# Altium schematic sheet Thermostat_16CH.SchDoc: Thermostat 8CH v1.1
size 420 x 297 mm; Author: G.Kasprowicz; CompanyName: WUT ISE; DrawnBy: G.Kasprowicz; Organization: WUT ISE; Address1: PW ISE; Address2: Nowowiejska 15/19 00-665 Warsaw; Address3: gkasprow@gmail.com; DocumentNumber: 1; Revision: 2; SheetNumber: 1; SheetTotal: 9; ModifiedBy: -; CheckedDate: -; Title2: TOP; DivGrp: WUT ISE; Designer: G.Kasprowicz; ModifiedDate: -; ProjectName: Sensor Box
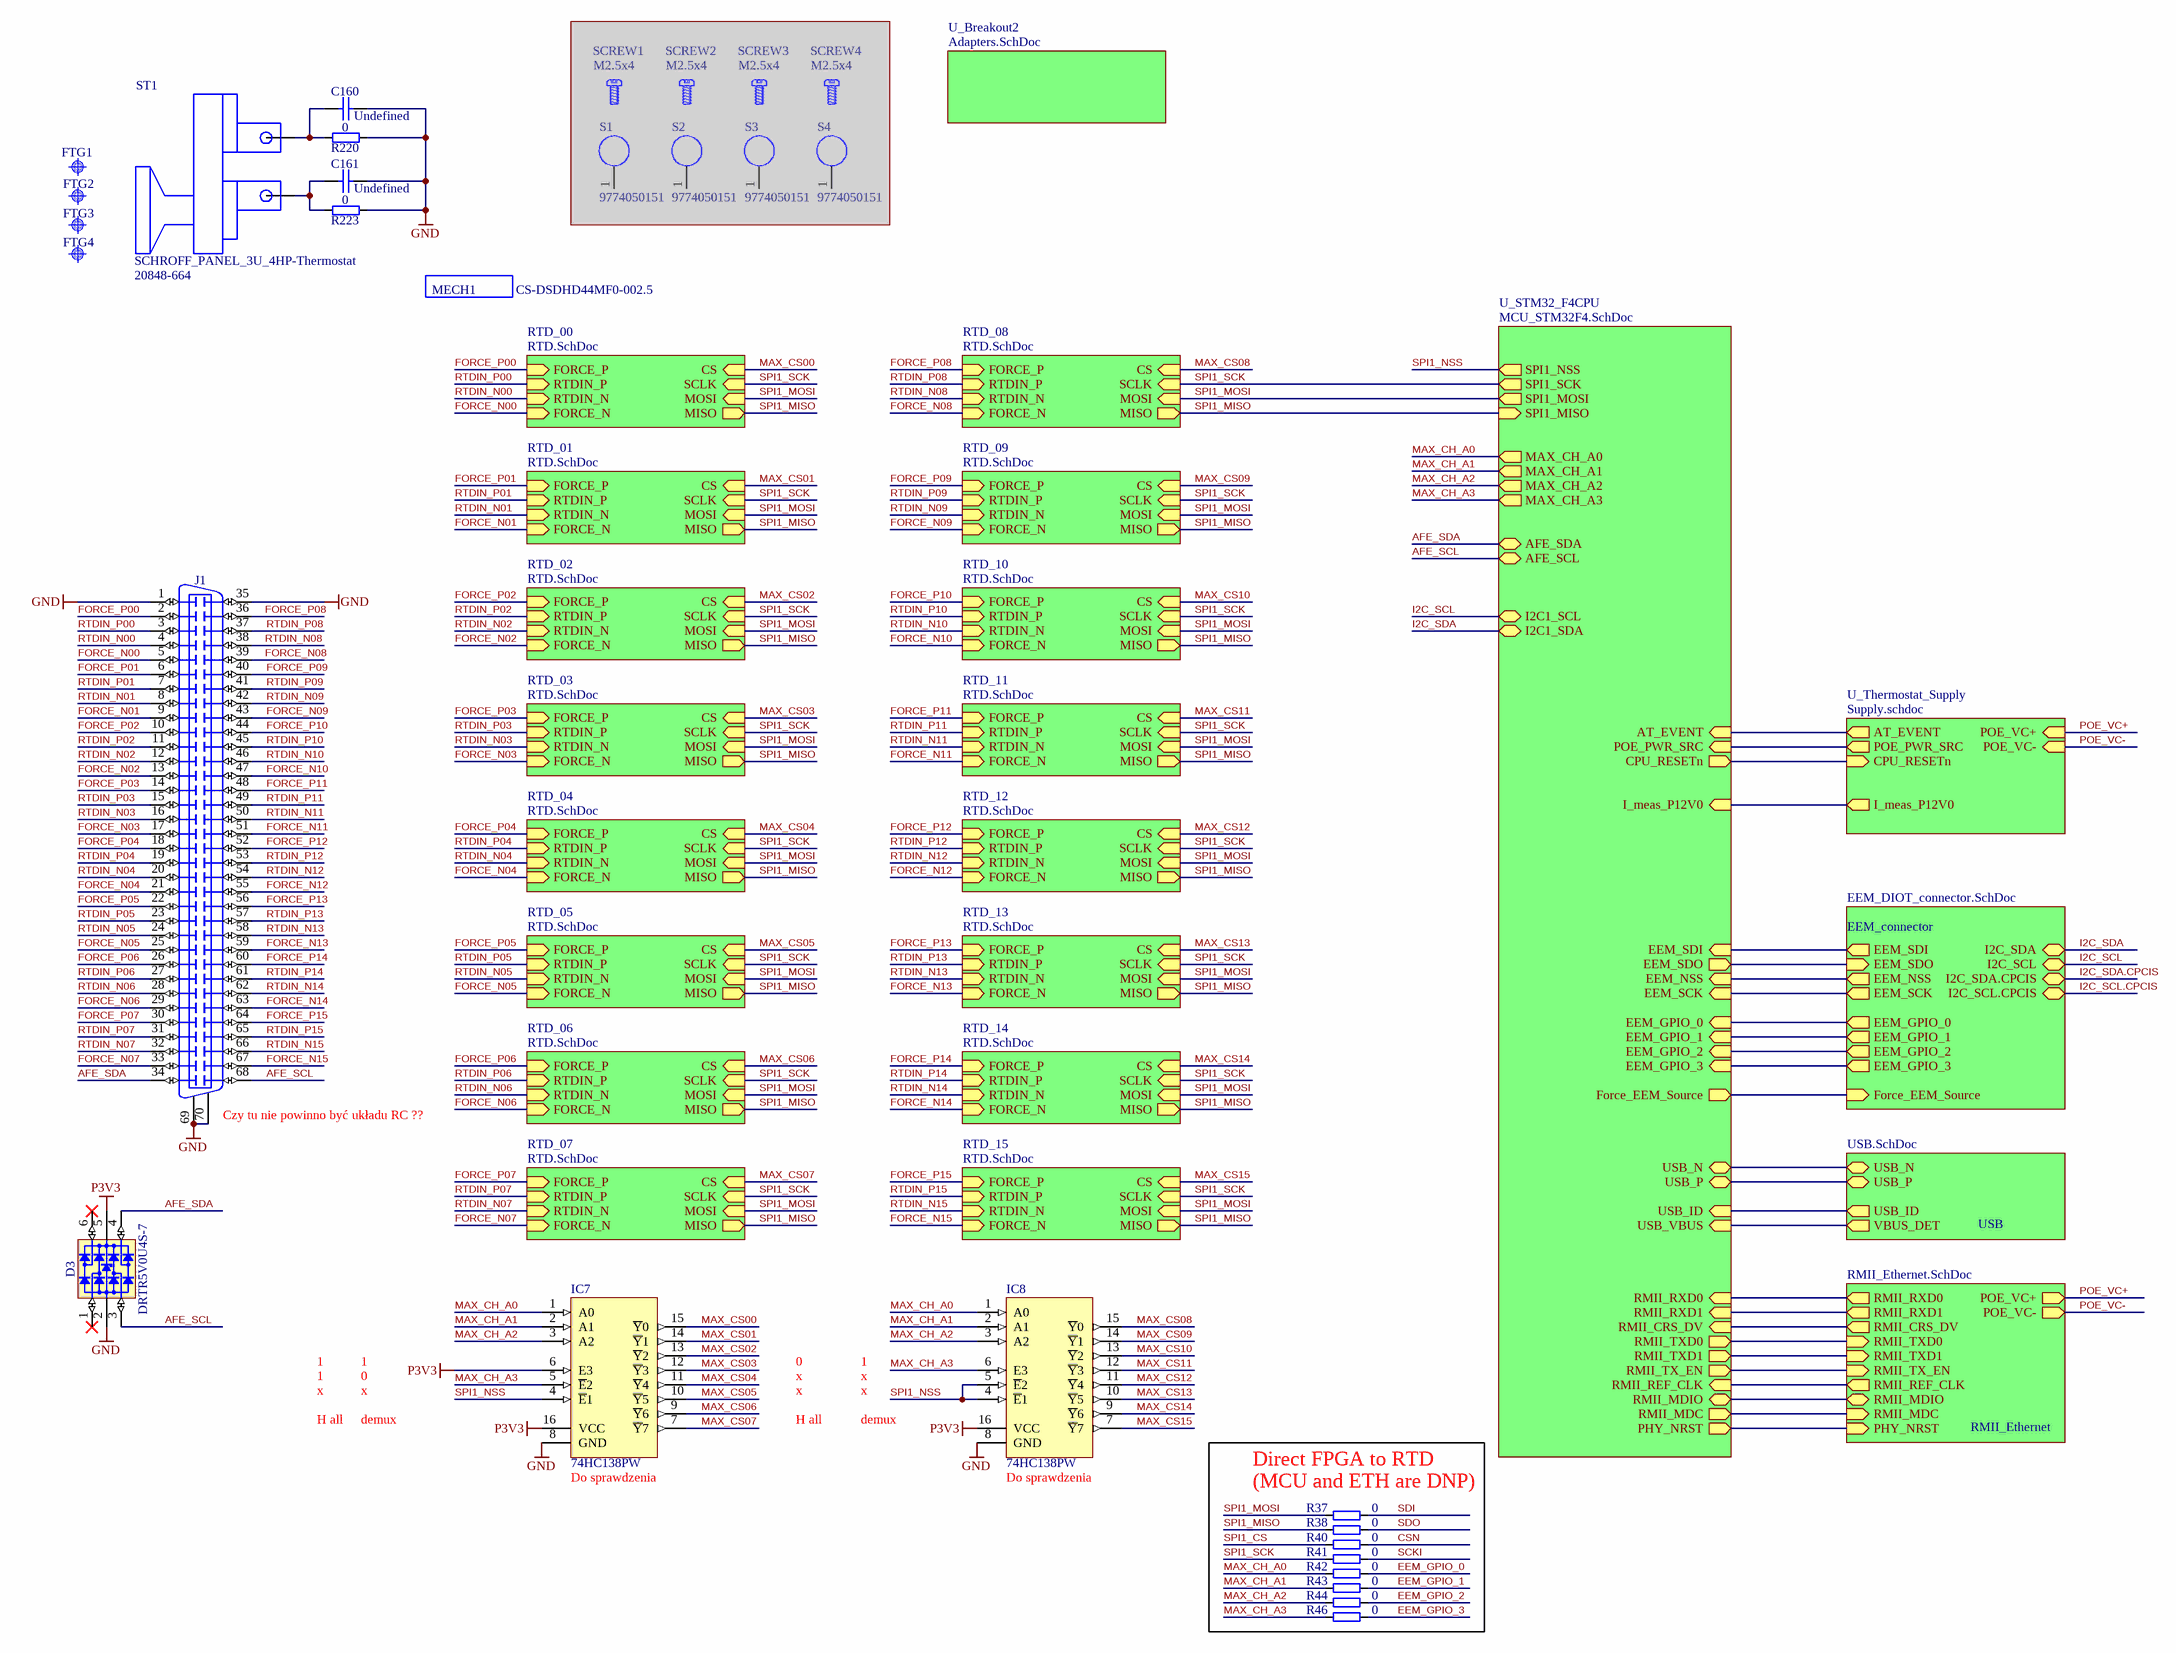
[diagram p0: Thermostat_16CH.SchDoc]

## Parts
C160  Undefined  [CAPC2012X135N]
C161  Undefined  [CAPC2012X135N]
D3  DRTR5V0U4S-7  [SOT65P210X110-6N]
FTG1  Use only in PCB  [FIDUCIAL_TOP_S100-200]  (value not drawn)  (no BOM)
FTG2  Use only in PCB  [FIDUCIAL_TOP_S100-200]  (value not drawn)  (no BOM)
FTG3  Use only in PCB  [FIDUCIAL_TOP_S100-200]  (value not drawn)  (no BOM)
FTG4  Use only in PCB  [FIDUCIAL_TOP_S100-200]  (value not drawn)  (no BOM)
IC7  74HC138PW  [SOP65P640X110-16N]
IC8  74HC138PW  [SOP65P640X110-16N]
J1  DNP  [MOLEX_71430-0013]  (value not drawn)
MECH1  CS-DSDHD44MF0-002.5  (mechanical)
R37  0  [RESC1608X55N]
R38  0  [RESC1608X55N]
R40  0  [RESC1608X55N]
R41  0  [RESC1608X55N]
R42  0  [RESC1608X55N]
R43  0  [RESC1608X55N]
R44  0  [RESC1608X55N]
R46  0  [RESC1608X55N]
R220  0  [RESC1608X55N]
R223  0  [RESC1608X55N]
S1  9774050151  [9774050151]  (masked out: inside a compile mask, not in the netlist)
S2  9774050151  [9774050151]  (masked out: inside a compile mask, not in the netlist)
S3  9774050151  [9774050151]  (masked out: inside a compile mask, not in the netlist)
S4  9774050151  [9774050151]  (masked out: inside a compile mask, not in the netlist)
SCREW1  M2.5x4  [BOSSARD_BN5687-3061587_v]  (masked out: inside a compile mask, not in the netlist)
SCREW2  M2.5x4  [BOSSARD_BN5687-3061587_v]  (masked out: inside a compile mask, not in the netlist)
SCREW3  M2.5x4  [BOSSARD_BN5687-3061587_v]  (masked out: inside a compile mask, not in the netlist)
SCREW4  M2.5x4  [BOSSARD_BN5687-3061587_v]  (masked out: inside a compile mask, not in the netlist)
ST1  SCHROFF_PANEL_3U_4HP-Thermostat  Manufacturer Part Number 2: 20848-664  [SCHROFF_PANEL_3HP_4U - Thermostat]

## Sub-sheets
EEM_connector = EEM_DIOT_connector.SchDoc: I2C_SDA (bidir), I2C_SCL (bidir), EEM_GPIO_0 (out), EEM_GPIO_1 (out), EEM_GPIO_2 (out), EEM_GPIO_3 (out), EEM_SCK (out), EEM_SDI (out), EEM_NSS (out), EEM_SDO (in), Force_EEM_Source (in), I2C_SDA.CPCIS (bidir), I2C_SCL.CPCIS (bidir)
RMII_Ethernet = RMII_Ethernet.SchDoc: RMII_TXD0 (in), RMII_TX_EN (in), RMII_RXD0 (out), RMII_REF_CLK (out), RMII_CRS_DV (out), RMII_MDC (in), RMII_MDIO (bidir), PHY_NRST (in), RMII_TXD1 (in), RMII_RXD1 (out), POE_VC+ (out), POE_VC- (out)
RTD_00 = RTD.SchDoc: SCLK (in), MOSI (in), CS (in), MISO (out), RTDIN_P (in), RTDIN_N (in), FORCE_P (in), FORCE_N (in)
RTD_01 = RTD.SchDoc: SCLK (in), MOSI (in), CS (in), MISO (out), RTDIN_P (in), RTDIN_N (in), FORCE_P (in), FORCE_N (in)
RTD_02 = RTD.SchDoc: SCLK (in), MOSI (in), CS (in), MISO (out), RTDIN_P (in), RTDIN_N (in), FORCE_P (in), FORCE_N (in)
RTD_03 = RTD.SchDoc: SCLK (in), MOSI (in), CS (in), MISO (out), RTDIN_P (in), RTDIN_N (in), FORCE_P (in), FORCE_N (in)
RTD_04 = RTD.SchDoc: SCLK (in), MOSI (in), CS (in), MISO (out), RTDIN_P (in), RTDIN_N (in), FORCE_P (in), FORCE_N (in)
RTD_05 = RTD.SchDoc: SCLK (in), MOSI (in), CS (in), MISO (out), RTDIN_P (in), RTDIN_N (in), FORCE_P (in), FORCE_N (in)
RTD_06 = RTD.SchDoc: SCLK (in), MOSI (in), CS (in), MISO (out), RTDIN_P (in), RTDIN_N (in), FORCE_P (in), FORCE_N (in)
RTD_07 = RTD.SchDoc: SCLK (in), MOSI (in), CS (in), MISO (out), RTDIN_P (in), RTDIN_N (in), FORCE_P (in), FORCE_N (in)
RTD_08 = RTD.SchDoc: SCLK (in), MOSI (in), CS (in), MISO (out), RTDIN_P (in), RTDIN_N (in), FORCE_P (in), FORCE_N (in)
RTD_09 = RTD.SchDoc: SCLK (in), MOSI (in), CS (in), MISO (out), RTDIN_P (in), RTDIN_N (in), FORCE_P (in), FORCE_N (in)
RTD_10 = RTD.SchDoc: SCLK (in), MOSI (in), CS (in), MISO (out), RTDIN_P (in), RTDIN_N (in), FORCE_P (in), FORCE_N (in)
RTD_11 = RTD.SchDoc: SCLK (in), MOSI (in), CS (in), MISO (out), RTDIN_P (in), RTDIN_N (in), FORCE_P (in), FORCE_N (in)
RTD_12 = RTD.SchDoc: SCLK (in), MOSI (in), CS (in), MISO (out), RTDIN_P (in), RTDIN_N (in), FORCE_P (in), FORCE_N (in)
RTD_13 = RTD.SchDoc: SCLK (in), MOSI (in), CS (in), MISO (out), RTDIN_P (in), RTDIN_N (in), FORCE_P (in), FORCE_N (in)
RTD_14 = RTD.SchDoc: SCLK (in), MOSI (in), CS (in), MISO (out), RTDIN_P (in), RTDIN_N (in), FORCE_P (in), FORCE_N (in)
RTD_15 = RTD.SchDoc: SCLK (in), MOSI (in), CS (in), MISO (out), RTDIN_P (in), RTDIN_N (in), FORCE_P (in), FORCE_N (in)
U_Breakout2 = Adapters.SchDoc: no entries
U_STM32_F4CPU = MCU_STM32F4.SchDoc: RMII_RXD0 (in), RMII_TXD0 (out), RMII_RXD1 (in), RMII_MDC (out), RMII_TXD1 (out), RMII_TX_EN (out), RMII_CRS_DV (in), RMII_REF_CLK (in), RMII_MDIO (bidir), PHY_NRST (out), USB_ID (in), USB_N (bidir), USB_P (bidir), USB_VBUS (in), EEM_SDI (in), EEM_SDO (out), EEM_NSS (in), EEM_SCK (in), EEM_GPIO_0 (in), EEM_GPIO_1 (in), Force_EEM_Source (out), SPI1_NSS (out), SPI1_SCK (out), SPI1_MISO (in), SPI1_MOSI (out), MAX_CH_A0 (out), MAX_CH_A1 (out), MAX_CH_A2 (out), MAX_CH_A3 (out), AFE_SCL (bidir), AFE_SDA (bidir), POE_PWR_SRC (in), I_meas_P12V0 (in), CPU_RESETn (out), AT_EVENT (in), I2C1_SCL (bidir), I2C1_SDA (bidir), EEM_GPIO_2 (in), EEM_GPIO_3 (in)
U_Thermostat_Supply = Supply.schdoc: POE_VC+ (in), POE_VC- (in), AT_EVENT (out), CPU_RESETn (in), POE_PWR_SRC (out), I_meas_P12V0 (out)
USB = USB.SchDoc: VBUS_DET (out), USB_N (bidir), USB_P (bidir), USB_ID (out)

## Nets
GND: C160.2 C161.2 D3.2(GND) IC7.8(GND) IC8.8(GND) J1.1 J1.35 J1.69 J1.70 R220.1 R223.1
P3V3: D3.5(VBUS) IC7.6(E3) IC7.16(VCC) IC8.16(VCC)
AFE_SCL: D3.3(I/O2) J1.68 ; sheet U_STM32_F4CPU/AFE_SCL
AFE_SDA: D3.4(I/O3) J1.34 ; sheet U_STM32_F4CPU/AFE_SDA
CSN: R40.2
EEM_GPIO_0: R42.2
EEM_GPIO_1: R43.2
EEM_GPIO_2: R44.2
EEM_GPIO_3: R46.2
FORCE_N00: J1.5 ; sheet RTD_00/FORCE_N
FORCE_N01: J1.9 ; sheet RTD_01/FORCE_N
FORCE_N02: J1.13 ; sheet RTD_02/FORCE_N
FORCE_N03: J1.17 ; sheet RTD_03/FORCE_N
FORCE_N04: J1.21 ; sheet RTD_04/FORCE_N
FORCE_N05: J1.25 ; sheet RTD_05/FORCE_N
FORCE_N06: J1.29 ; sheet RTD_06/FORCE_N
FORCE_N07: J1.33 ; sheet RTD_07/FORCE_N
FORCE_N08: J1.39 ; sheet RTD_08/FORCE_N
FORCE_N09: J1.43 ; sheet RTD_09/FORCE_N
FORCE_N10: J1.47 ; sheet RTD_10/FORCE_N
FORCE_N11: J1.51 ; sheet RTD_11/FORCE_N
FORCE_N12: J1.55 ; sheet RTD_12/FORCE_N
FORCE_N13: J1.59 ; sheet RTD_13/FORCE_N
FORCE_N14: J1.63 ; sheet RTD_14/FORCE_N
FORCE_N15: J1.67 ; sheet RTD_15/FORCE_N
FORCE_P00: J1.2 ; sheet RTD_00/FORCE_P
FORCE_P01: J1.6 ; sheet RTD_01/FORCE_P
FORCE_P02: J1.10 ; sheet RTD_02/FORCE_P
FORCE_P03: J1.14 ; sheet RTD_03/FORCE_P
FORCE_P04: J1.18 ; sheet RTD_04/FORCE_P
FORCE_P05: J1.22 ; sheet RTD_05/FORCE_P
FORCE_P06: J1.26 ; sheet RTD_06/FORCE_P
FORCE_P07: J1.30 ; sheet RTD_07/FORCE_P
FORCE_P08: J1.36 ; sheet RTD_08/FORCE_P
FORCE_P09: J1.40 ; sheet RTD_09/FORCE_P
FORCE_P10: J1.44 ; sheet RTD_10/FORCE_P
FORCE_P11: J1.48 ; sheet RTD_11/FORCE_P
FORCE_P12: J1.52 ; sheet RTD_12/FORCE_P
FORCE_P13: J1.56 ; sheet RTD_13/FORCE_P
FORCE_P14: J1.60 ; sheet RTD_14/FORCE_P
FORCE_P15: J1.64 ; sheet RTD_15/FORCE_P
I2C_SCL: sheet U_STM32_F4CPU/I2C1_SCL, sheet EEM_connector/I2C_SCL
I2C_SCL.CPCIS: sheet EEM_connector/I2C_SCL.CPCIS
I2C_SDA: sheet U_STM32_F4CPU/I2C1_SDA, sheet EEM_connector/I2C_SDA
I2C_SDA.CPCIS: sheet EEM_connector/I2C_SDA.CPCIS
MAX_CH_A0: IC7.1(A0) IC8.1(A0) R42.1 ; sheet U_STM32_F4CPU/MAX_CH_A0
MAX_CH_A1: IC7.2(A1) IC8.2(A1) R43.1 ; sheet U_STM32_F4CPU/MAX_CH_A1
MAX_CH_A2: IC7.3(A2) IC8.3(A2) R44.1 ; sheet U_STM32_F4CPU/MAX_CH_A2
MAX_CH_A3: IC7.5(~{E}2) IC8.6(E3) R46.1 ; sheet U_STM32_F4CPU/MAX_CH_A3
MAX_CS00: IC7.15(~{Y}0) ; sheet RTD_00/CS
MAX_CS01: IC7.14(~{Y}1) ; sheet RTD_01/CS
MAX_CS02: IC7.13(~{Y}2) ; sheet RTD_02/CS
MAX_CS03: IC7.12(~{Y}3) ; sheet RTD_03/CS
MAX_CS04: IC7.11(~{Y}4) ; sheet RTD_04/CS
MAX_CS05: IC7.10(~{Y}5) ; sheet RTD_05/CS
MAX_CS06: IC7.9(~{Y}6) ; sheet RTD_06/CS
MAX_CS07: IC7.7(~{Y}7) ; sheet RTD_07/CS
MAX_CS08: IC8.15(~{Y}0) ; sheet RTD_08/CS
MAX_CS09: IC8.14(~{Y}1) ; sheet RTD_09/CS
MAX_CS10: IC8.13(~{Y}2) ; sheet RTD_10/CS
MAX_CS11: IC8.12(~{Y}3) ; sheet RTD_11/CS
MAX_CS12: IC8.11(~{Y}4) ; sheet RTD_12/CS
MAX_CS13: IC8.10(~{Y}5) ; sheet RTD_13/CS
MAX_CS14: IC8.9(~{Y}6) ; sheet RTD_14/CS
MAX_CS15: IC8.7(~{Y}7) ; sheet RTD_15/CS
POE_VC+: sheet RMII_Ethernet/POE_VC+, sheet U_Thermostat_Supply/POE_VC+
POE_VC-: sheet RMII_Ethernet/POE_VC-, sheet U_Thermostat_Supply/POE_VC-
RTDIN_N00: J1.4 ; sheet RTD_00/RTDIN_N
RTDIN_N01: J1.8 ; sheet RTD_01/RTDIN_N
RTDIN_N02: J1.12 ; sheet RTD_02/RTDIN_N
RTDIN_N03: J1.16 ; sheet RTD_03/RTDIN_N
RTDIN_N04: J1.20 ; sheet RTD_04/RTDIN_N
RTDIN_N05: J1.24 ; sheet RTD_05/RTDIN_N
RTDIN_N06: J1.28 ; sheet RTD_06/RTDIN_N
RTDIN_N07: J1.32 ; sheet RTD_07/RTDIN_N
RTDIN_N08: J1.38 ; sheet RTD_08/RTDIN_N
RTDIN_N09: J1.42 ; sheet RTD_09/RTDIN_N
RTDIN_N10: J1.46 ; sheet RTD_10/RTDIN_N
RTDIN_N11: J1.50 ; sheet RTD_11/RTDIN_N
RTDIN_N12: J1.54 ; sheet RTD_12/RTDIN_N
RTDIN_N13: J1.58 ; sheet RTD_13/RTDIN_N
RTDIN_N14: J1.62 ; sheet RTD_14/RTDIN_N
RTDIN_N15: J1.66 ; sheet RTD_15/RTDIN_N
RTDIN_P00: J1.3 ; sheet RTD_00/RTDIN_P
RTDIN_P01: J1.7 ; sheet RTD_01/RTDIN_P
RTDIN_P02: J1.11 ; sheet RTD_02/RTDIN_P
RTDIN_P03: J1.15 ; sheet RTD_03/RTDIN_P
RTDIN_P04: J1.19 ; sheet RTD_04/RTDIN_P
RTDIN_P05: J1.23 ; sheet RTD_05/RTDIN_P
RTDIN_P06: J1.27 ; sheet RTD_06/RTDIN_P
RTDIN_P07: J1.31 ; sheet RTD_07/RTDIN_P
RTDIN_P08: J1.37 ; sheet RTD_08/RTDIN_P
RTDIN_P09: J1.41 ; sheet RTD_09/RTDIN_P
RTDIN_P10: J1.45 ; sheet RTD_10/RTDIN_P
RTDIN_P11: J1.49 ; sheet RTD_11/RTDIN_P
RTDIN_P12: J1.53 ; sheet RTD_12/RTDIN_P
RTDIN_P13: J1.57 ; sheet RTD_13/RTDIN_P
RTDIN_P14: J1.61 ; sheet RTD_14/RTDIN_P
RTDIN_P15: J1.65 ; sheet RTD_15/RTDIN_P
SCKI: R41.2
SDI: R37.2
SDO: R38.2
SPI1_CS: R40.1
SPI1_MISO: R38.1 ; sheet U_STM32_F4CPU/SPI1_MISO, sheet RTD_00/MISO, sheet RTD_01/MISO, sheet RTD_02/MISO, sheet RTD_03/MISO, sheet RTD_04/MISO, sheet RTD_05/MISO, sheet RTD_06/MISO, sheet RTD_07/MISO, sheet RTD_08/MISO, sheet RTD_09/MISO, sheet RTD_10/MISO, sheet RTD_11/MISO, sheet RTD_12/MISO, sheet RTD_13/MISO, sheet RTD_14/MISO, sheet RTD_15/MISO
SPI1_MOSI: R37.1 ; sheet U_STM32_F4CPU/SPI1_MOSI, sheet RTD_00/MOSI, sheet RTD_01/MOSI, sheet RTD_02/MOSI, sheet RTD_03/MOSI, sheet RTD_04/MOSI, sheet RTD_05/MOSI, sheet RTD_06/MOSI, sheet RTD_07/MOSI, sheet RTD_08/MOSI, sheet RTD_09/MOSI, sheet RTD_10/MOSI, sheet RTD_11/MOSI, sheet RTD_12/MOSI, sheet RTD_13/MOSI, sheet RTD_14/MOSI, sheet RTD_15/MOSI
SPI1_NSS: IC7.4(~{E}1) IC8.4(~{E}1) IC8.5(~{E}2) ; sheet U_STM32_F4CPU/SPI1_NSS
SPI1_SCK: R41.1 ; sheet U_STM32_F4CPU/SPI1_SCK, sheet RTD_00/SCLK, sheet RTD_01/SCLK, sheet RTD_02/SCLK, sheet RTD_03/SCLK, sheet RTD_04/SCLK, sheet RTD_05/SCLK, sheet RTD_06/SCLK, sheet RTD_07/SCLK, sheet RTD_08/SCLK, sheet RTD_09/SCLK, sheet RTD_10/SCLK, sheet RTD_11/SCLK, sheet RTD_12/SCLK, sheet RTD_13/SCLK, sheet RTD_14/SCLK, sheet RTD_15/SCLK
NetC160_1: C160.1 R220.2 ST1.1
NetC161_1: C161.1 R223.2 ST1.0
(unnamed): sheet U_STM32_F4CPU/RMII_RXD0, sheet RMII_Ethernet/RMII_RXD0
(unnamed): sheet U_STM32_F4CPU/RMII_TXD0, sheet RMII_Ethernet/RMII_TXD0
(unnamed): sheet U_STM32_F4CPU/RMII_RXD1, sheet RMII_Ethernet/RMII_RXD1
(unnamed): sheet U_STM32_F4CPU/RMII_MDC, sheet RMII_Ethernet/RMII_MDC
(unnamed): sheet U_STM32_F4CPU/RMII_TXD1, sheet RMII_Ethernet/RMII_TXD1
(unnamed): sheet U_STM32_F4CPU/RMII_TX_EN, sheet RMII_Ethernet/RMII_TX_EN
(unnamed): sheet U_STM32_F4CPU/RMII_CRS_DV, sheet RMII_Ethernet/RMII_CRS_DV
(unnamed): sheet U_STM32_F4CPU/RMII_REF_CLK, sheet RMII_Ethernet/RMII_REF_CLK
(unnamed): sheet U_STM32_F4CPU/RMII_MDIO, sheet RMII_Ethernet/RMII_MDIO
(unnamed): sheet U_STM32_F4CPU/PHY_NRST, sheet RMII_Ethernet/PHY_NRST
(unnamed): sheet U_STM32_F4CPU/USB_ID, sheet USB/USB_ID
(unnamed): sheet U_STM32_F4CPU/USB_N, sheet USB/USB_N
(unnamed): sheet U_STM32_F4CPU/USB_P, sheet USB/USB_P
(unnamed): sheet U_STM32_F4CPU/USB_VBUS, sheet USB/VBUS_DET
(unnamed): sheet U_STM32_F4CPU/EEM_SDI, sheet EEM_connector/EEM_SDI
(unnamed): sheet U_STM32_F4CPU/EEM_SDO, sheet EEM_connector/EEM_SDO
(unnamed): sheet U_STM32_F4CPU/EEM_NSS, sheet EEM_connector/EEM_NSS
(unnamed): sheet U_STM32_F4CPU/EEM_SCK, sheet EEM_connector/EEM_SCK
(unnamed): sheet U_STM32_F4CPU/EEM_GPIO_0, sheet EEM_connector/EEM_GPIO_0
(unnamed): sheet U_STM32_F4CPU/EEM_GPIO_1, sheet EEM_connector/EEM_GPIO_1
(unnamed): sheet U_STM32_F4CPU/Force_EEM_Source, sheet EEM_connector/Force_EEM_Source
(unnamed): sheet U_STM32_F4CPU/POE_PWR_SRC, sheet U_Thermostat_Supply/POE_PWR_SRC
(unnamed): sheet U_STM32_F4CPU/I_meas_P12V0, sheet U_Thermostat_Supply/I_meas_P12V0
(unnamed): sheet U_STM32_F4CPU/CPU_RESETn, sheet U_Thermostat_Supply/CPU_RESETn
(unnamed): sheet U_STM32_F4CPU/AT_EVENT, sheet U_Thermostat_Supply/AT_EVENT
(unnamed): sheet U_STM32_F4CPU/EEM_GPIO_2, sheet EEM_connector/EEM_GPIO_2
(unnamed): sheet U_STM32_F4CPU/EEM_GPIO_3, sheet EEM_connector/EEM_GPIO_3

Not connected (* = marked no-connect by the designer): D3 1(I/O1)* 6(I/O4)*

## Notes on the sheet
- (near J1) Czy tu nie powinno być układu RC ??
- 1
- x
- 0
- H all
- demux
- Direct FPGA to RTD
- (near IC7) Do sprawdzenia
- (near IC8) Do sprawdzenia
- (MCU and ETH are DNP)
- Project/Equipment
- Document
- Designer
- Drawn by
- Check.by
- Copyright WUT ISE 2020.
  This documentation describes Open Hardware and is licensed under the CERN OHL v.1.2. You may redistribute and modify this documentation under the terms of the CERN OHL v.1.2. (http://ohwr.org/CERNOHL). This documentation is distributed WITHOUT ANY EXPRESS OR IMPLIED WARRANTY, INCLUDING OF MERCHANTABILITY, SATISFACTORY QUALITY AND FITNESS FOR A PARTICULAR PURPOSE. Please see the CERN OHL v.1.2 for applicable conditions.
- Contact
- File
- Last Mod.
- Print Date
- Sheet
- Size
- A3
- of
- Rev

## Library data of the parts
C160 C161 = CC0805_NO-VALUE: Non-polarised capacitor; Part Description: Reserved Footprint For 0805(2012) Chip Ceramic Capacitor; Mounted: No; Part Number: CC0805_NO-VALUE; Component Kind: Standard; Component Type: Standard; Pin Count: 2; Value: Undefined; Status: None; Manufacturer: Undefined; Manufacturer Part Number: CC0805_NO-VALUE; Case: 0805; Socket: No; SMD: Yes; Sense: No; Manufacturer1 ComponentHeight: 1.35mm; HelpURL: Undefined; Author: CERN DEM JLC; CreateDate: 10.12.2008; LatestRevisionDate: 11.09.2013
D3 = D_TVS_DRTR5V0U4S-7: Integrated Quad Ultra-Low Capacitance ESD Protection; Part Description: Integrated Quad Ultra-Low Capacitance ESD (±8kV) Protection; Manufacturer: DIODES; PressFit: No; Bonding: No; Status Comment: Active; Part Number: DRTR5V0U4S-7; Component Kind: Standard; Component Type: Standard; Device: DRTR5V0U4S-7; PackageDescription: SOT363, SC70-6, 0.65mm Pitch; 6 Pin, 1.25mm W X 2.00mm L X 1.10mm H body, IPC Medium Density; Status: Active; Manufacturer Part Number: DRTR5V0U4S-7; Pin Count: 6; Case: SOT363; Mounted: Yes; Socket: No; SMD: Yes; Sense: No; ComponentHeight: 1.1mm; HelpURL: \\cern.ch\dfs\Applications\Altium\Datasheets\PRTR5V0U4Y.pdf; Author: GK; CreateDate: 24.01.2017; LatestRevisionDate: 14.09.2020
FTG1-FTG4 = FIDUCIAL_TARGET_S100-200: Fiducial Target; Part Description: Square Fiducial Target, Top Layer, 1.0mm, Top Solder 2.0mm, Keepout =2.0mm; Mounted: No; Part Number: FIDUCIAL_TARGET_S100-200; Component Type: Standard (No BOM); Pin Count: 1; Family: Fiducial; Socket: No; SMD: Yes; Sense: No; Status: None; ComponentHeight: 0mm; HelpURL: Undefined; Author: CERN DEM JLC; CreateDate: 09.02.2010; LatestRevisionDate: 04.04.2012; PackageDescription: Square Fiducial Target, Top Layer, 1.0mm, Top Solder 2.0mm, Keepout =2.0mm
IC7 IC8 = 74HC138PW: 3-Line to 8-Line Decoder/Demultiplexer; Part Description: 3-Line to 8-Line Decoder/Demultiplexer, Inverting; Manufacturer: NXP SEMICONDUCTORS; PressFit: No; Bonding: No; Part Number: 74HC138PW; Component Kind: Standard; Component Type: Standard; Device: 74HC138PW; PackageDescription: SOP, 0.65mm pitch; 16 pin, 4.40mm W X 5.00mm L X 1.10mm H body IPC Medium Density; Manufacturer Part Number: 74HC138PW; Pin Count: 16; Case: TSSOP16; Mounted: Yes; Socket: No; SMD: Yes; Sense: No; ComponentHeight: 1.1mm; Author: CERN DEM JLC; HelpURL: \\cern.ch\dfs\Applications\Altium\Datasheets\74HC138PW.pdf; CreateDate: 09/06/2015; LatestRevisionDate: 09/06/2015
J1 = MOLEX_71430-0013: Very High Density Cable Interconnect (VHDCI ) 68 Female; Part Description: 68 Positions, Pitch 0.8mm, Very Hight Density Right Angle Receptacle, VHDCI Standard (Recommended PCB Thickness: 1.6mm); Manufacturer: MOLEX; PressFit: No; Part Number: MOLEX_71430-0013; Component Kind: Standard; Component Type: Standard; Pin Count: 70; Family: VHDCI; Mounted: Yes; Socket: No; SMD: No; Status: None; Manufacturer Part Number: 71430-0013; ComponentHeight: 6.28mm; HelpURL: \\cern.ch\dfs\Applications\Altium\Datasheets\MOLEX_71430-0013.pdf; Author: CERN DEM JLC; CreateDate: 2014-01-30; LatestRevisionDate: 2014-01-30; Table: MOLEX
MECH1 = Generic_mechanical: D-Sub Cables DELUXE HD44 M/F MOLDED 2.5'; Part Description: D-sub44 cable; Manufacturer: Amphenol; PressFit: No; Value: 750mm; Part Number: CS-DSDHD44MF0-002.5; Component Type: Standard; Footprint: generic_MECH; Pin Count: 0; PackageDescription: generic; Mounted: Yes; Socket: No; SMD: No; Sense: No; Status: None; Manufacturer Part Number: CS-DSDHD44MF0-002.5; ComponentHeight: generic; Author: GK; CreateDate: 28.10.2019; LatestRevisionDate: 28.10.2019
R37 R38 R40-R44 R46 R220 R223 = R0603_0R_JUMPER: Resistor; Part Description: 1A (0.05R Max DC Resistance) Zero Ohm Jumper; Manufacturer: GENERIC; Manufacturer1 Part Number: NRC06Z0; PressFit: No; Part Number: R0603_0R_JUMPER; Component Kind: Standard; Component Type: Standard; Pin Count: 2; Value: 0; Status: Preferred; Manufacturer Part Number: R0603_0R_JUMPER; Case: 0603; Mounted: Yes; Sense: No; Socket: No; SMD: Yes; Manufacturer1 Example: NIC COMPONENT; Manufacturer1 ComponentHeight: 0.55mm; HelpURL: \\cern.ch\dfs\Applications\Altium\Datasheets\R0603_NIC_NRC.pdf; Author: CERN DEM JLC; CreateDate: 03.12.2007; LatestRevisionDate: 13.03.2008
S1-S4 = WA-SMSI,  9774050151: WA-SMSI SMD Steel Spacer with internal Thread; Manufacturer: Wurth Elektronik; partNo: 9774050151; ComponentLink1Description: Manufacturer; ComponentLink1URL: http://www.we-online.de; Created by: Baojun Chen; Created Date: 20.Oct.2015; ComponentLink2Description: Datasheet; ComponentLink2URL: http://katalog.we-online.de/em/datasheet/9774050151.pdf
SCREW1-SCREW4 = BOSSARD_BN5687-3061587_v: Screw; Part Description: M2.5 L=4mm Hexalobular Socket Pan Head Screw, Fully Threaded, Stainless Steel A2; Manufacturer Part Number: BN5687 Art.3061587; PressFit: No; Part Number: BOSSARD_BN5687-3061587_v; Component Kind: Standard; Component Type: Mechanical; Pin Count: 0; PackageDescription: M2.5 L=4mm Hexalobular Socket Pan Head Screw, Fully Threaded - Stainless Steel A2; Mounted: Yes; Socket: No; SMD: No; Sense: No; Status: None; Value: M2.5x4; Manufacturer: BOSSARD; ComponentHeight: 5mm; HelpURL: \\cern.ch\dfs\Applications\Altium\Datasheets\BOSSARD_BN5687-3061587.pdf; Author: CERN DEM JLC; CreateDate: 22.08.2013; LatestRevisionDate: 22.08.2013
ST1 = SCHROFF_PANEL_3U_4HP_Thermostat: Schroff 3HP 4U EUROCARD Panel; Manufacturer Part Number: 20818-017; Manufacturer: Schroff